# Altium schematic sheet 2_mb_conn.SchDoc: Motherboard connectors
size A3; SheetNumber: 2; SheetTotal: 8
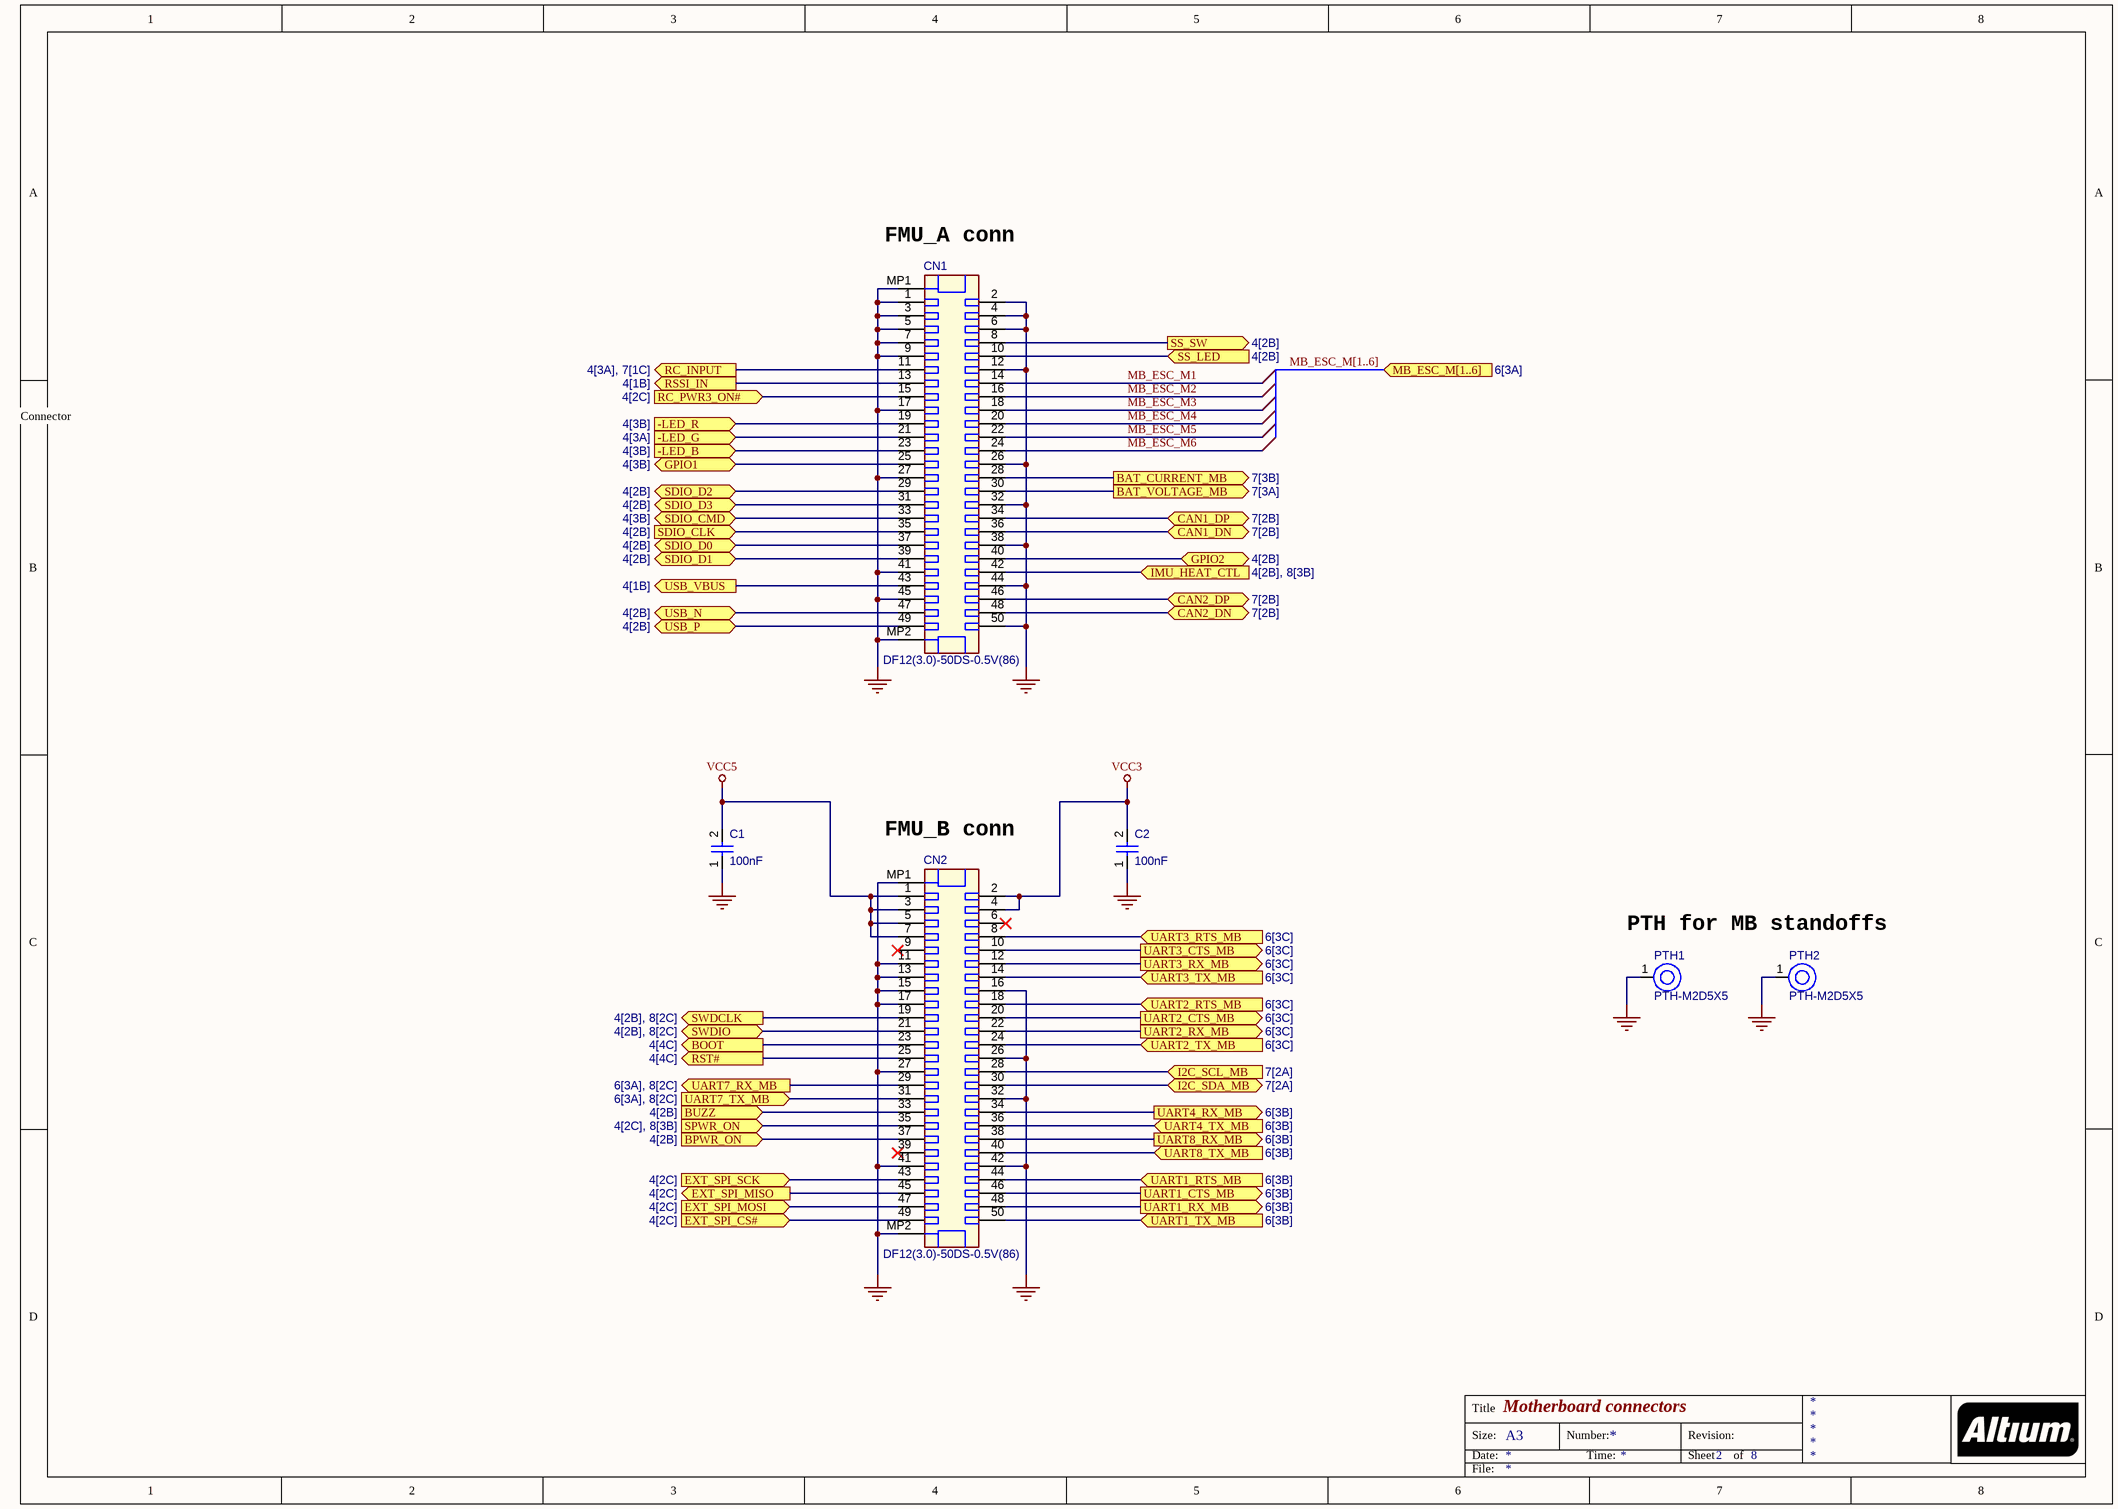
[diagram p0: 2_mb_conn.SchDoc]

## Parts
C1  value 100nF  [CAPC0402(1005)60_L]  (hidden comment: Capacitor 100nF +/-20% 10V 0402)
C2  value 100nF  [CAPC0402(1005)60_L]  (hidden comment: Capacitor 100nF +/-20% 10V 0402)
CN1  DF12(3.0)-50DS-0.5V(86)  [HIRO-DF12(3.0)-50DS-0.5V_V]
CN2  DF12(3.0)-50DS-0.5V(86)  [HIRO-DF12(3.0)-50DS-0.5V_V]
PTH1  PTH-M2D5X5  [PTH-M2D5X5]
PTH2  PTH-M2D5X5  [PTH-M2D5X5]

## Ports
-LED_B (in, see 4[3B]), -LED_G (in, see 4[3A]), -LED_R (in, see 4[3B]), BAT_CURRENT_MB (out, see 7[3B]), BAT_VOLTAGE_MB (out, see 7[3A]), BOOT (out, see 4[4C]), BPWR_ON (in, see 4[2B]), BUZZ (in, see 4[2B]), CAN1_DN (bidir, see 7[2B]), CAN1_DP (bidir, see 7[2B]), CAN2_DN (bidir, see 7[2B]), CAN2_DP (bidir, see 7[2B]), EXT_SPI_CS# (in, see 4[2C]), EXT_SPI_MISO (out, see 4[2C]), EXT_SPI_MOSI (in, see 4[2C]), EXT_SPI_SCK (in, see 4[2C]), GPIO1 (bidir, see 4[3B]), GPIO2 (bidir, see 4[2B]), I2C_SCL_MB (in, see 7[2A]), I2C_SDA_MB (bidir, see 7[2A]), IMU_HEAT_CTL (in, see 4[2B], 8[3B]), MB_ESC_M[1..6] (in, see 6[3A]), RC_INPUT (out, see 4[3A], 7[1C]), RC_PWR3_ON# (in, see 4[2C]), RSSI_IN (out, see 4[1B]), RST# (out, see 4[4C]), SDIO_CLK (in, see 4[2B]), SDIO_CMD (bidir, see 4[3B]), SDIO_D0 (bidir, see 4[2B]), SDIO_D1 (bidir, see 4[2B]), SDIO_D2 (bidir, see 4[2B]), SDIO_D3 (bidir, see 4[2B]), SPWR_ON (in, see 4[2C], 8[3B]), SS_LED (in, see 4[2B]), SS_SW (out, see 4[2B]), SWDCLK (out, see 4[2B], 8[2C]), SWDIO (bidir, see 4[2B], 8[2C]), UART1_CTS_MB (out, see 6[3B]), UART1_RTS_MB (in, see 6[3B]), UART1_RX_MB (out, see 6[3B]), UART1_TX_MB (in, see 6[3B]), UART2_CTS_MB (out, see 6[3C]), UART2_RTS_MB (in, see 6[3C]), UART2_RX_MB (out, see 6[3C]), UART2_TX_MB (in, see 6[3C]), UART3_CTS_MB (out, see 6[3C]), UART3_RTS_MB (in, see 6[3C]), UART3_RX_MB (out, see 6[3C]), UART3_TX_MB (in, see 6[3C]), UART4_RX_MB (out, see 6[3B]), UART4_TX_MB (in, see 6[3B]), UART7_RX_MB (out, see 6[3A], 8[2C]), UART7_TX_MB (in, see 6[3A], 8[2C]), UART8_RX_MB (out, see 6[3B]), UART8_TX_MB (in, see 6[3B]), USB_N (bidir, see 4[2B]), USB_P (bidir, see 4[2B]), USB_VBUS (out, see 4[1B])

## Nets
GND: C1.1 C2.1 CN1.1 CN1.2 CN1.3 CN1.4 CN1.5 CN1.6 CN1.7 CN1.9 CN1.12 CN1.17 CN1.26 CN1.27 CN1.32 CN1.38 CN1.41 CN1.44 CN1.45 CN1.50 CN1.MP1 CN1.MP2 CN2.11 CN2.13 CN2.15 CN2.16 CN2.17 CN2.26 CN2.27 CN2.32 CN2.41 CN2.42 CN2.MP1 CN2.MP2 PTH1.1(H1) PTH2.1(H1)
VCC3: C2.2 CN2.2 CN2.4
VCC5: C1.2 CN2.1 CN2.3 CN2.5 CN2.7
-LED_B: CN1.23 ; port -LED_B
-LED_G: CN1.21 ; port -LED_G
-LED_R: CN1.19 ; port -LED_R
BAT_CURRENT_MB: CN1.28 ; port BAT_CURRENT_MB
BAT_VOLTAGE_MB: CN1.30 ; port BAT_VOLTAGE_MB
BOOT: CN2.23 ; port BOOT
BPWR_ON: CN2.37 ; port BPWR_ON
BUZZ: CN2.33 ; port BUZZ
CAN1_DN: CN1.36 ; port CAN1_DN
CAN1_DP: CN1.34 ; port CAN1_DP
CAN2_DN: CN1.48 ; port CAN2_DN
CAN2_DP: CN1.46 ; port CAN2_DP
EXT_SPI_CS#: CN2.49 ; port EXT_SPI_CS#
EXT_SPI_MISO: CN2.45 ; port EXT_SPI_MISO
EXT_SPI_MOSI: CN2.47 ; port EXT_SPI_MOSI
EXT_SPI_SCK: CN2.43 ; port EXT_SPI_SCK
GPIO1: CN1.25 ; port GPIO1
GPIO2: CN1.40 ; port GPIO2
I2C_SCL_MB: CN2.28 ; port I2C_SCL_MB
I2C_SDA_MB: CN2.30 ; port I2C_SDA_MB
IMU_HEAT_CTL: CN1.42 ; port IMU_HEAT_CTL
MB_ESC_M1: CN1.14
MB_ESC_M2: CN1.16
MB_ESC_M3: CN1.18
MB_ESC_M4: CN1.20
MB_ESC_M5: CN1.22
MB_ESC_M6: CN1.24
RC_INPUT: CN1.11 ; port RC_INPUT
RC_PWR3_ON#: CN1.15 ; port RC_PWR3_ON#
RSSI_IN: CN1.13 ; port RSSI_IN
RST#: CN2.25 ; port RST#
SDIO_CLK: CN1.35 ; port SDIO_CLK
SDIO_CMD: CN1.33 ; port SDIO_CMD
SDIO_D0: CN1.37 ; port SDIO_D0
SDIO_D1: CN1.39 ; port SDIO_D1
SDIO_D2: CN1.29 ; port SDIO_D2
SDIO_D3: CN1.31 ; port SDIO_D3
SPWR_ON: CN2.35 ; port SPWR_ON
SS_LED: CN1.10 ; port SS_LED
SS_SW: CN1.8 ; port SS_SW
SWDCLK: CN2.19 ; port SWDCLK
SWDIO: CN2.21 ; port SWDIO
UART1_CTS_MB: CN2.46 ; port UART1_CTS_MB
UART1_RTS_MB: CN2.44 ; port UART1_RTS_MB
UART1_RX_MB: CN2.48 ; port UART1_RX_MB
UART1_TX_MB: CN2.50 ; port UART1_TX_MB
UART2_CTS_MB: CN2.20 ; port UART2_CTS_MB
UART2_RTS_MB: CN2.18 ; port UART2_RTS_MB
UART2_RX_MB: CN2.22 ; port UART2_RX_MB
UART2_TX_MB: CN2.24 ; port UART2_TX_MB
UART3_CTS_MB: CN2.10 ; port UART3_CTS_MB
UART3_RTS_MB: CN2.8 ; port UART3_RTS_MB
UART3_RX_MB: CN2.12 ; port UART3_RX_MB
UART3_TX_MB: CN2.14 ; port UART3_TX_MB
UART4_RX_MB: CN2.34 ; port UART4_RX_MB
UART4_TX_MB: CN2.36 ; port UART4_TX_MB
UART7_RX_MB: CN2.29 ; port UART7_RX_MB
UART7_TX_MB: CN2.31 ; port UART7_TX_MB
UART8_RX_MB: CN2.38 ; port UART8_RX_MB
UART8_TX_MB: CN2.40 ; port UART8_TX_MB
USB_N: CN1.47 ; port USB_N
USB_P: CN1.49 ; port USB_P
USB_VBUS: CN1.43 ; port USB_VBUS

Not connected (* = marked no-connect by the designer): CN2 6* 9* 39*

## Buses and harness runs
bus MB_ESC_M[1..6] = port MB_ESC_M[1..6]

## Notes on the sheet
- (near CN1) FMU_A conn
- Connector
- (near CN2) FMU_B conn
- PTH for MB standoffs
- Title
- Size:
- Date:
- A3
- Number:
- Time:
- Revision:
- Sheet
- of
- File:

## Library data of the parts
C1 C2 = CMP-001-00061-2: Chip Capacitor, 100nF +/-20%, 10V, 0402, Thickness 0.6 mm; Tolerance: 20%; Voltage Rating: 10V; Mounting Technology: SMT; Min Operating Temperature: -55°C; Pins: 2; Case/Package: 0402; Max Operating Temperature: 85°C
CN1 CN2 = CMP-002-00058-1: Receptacle Connector, 50 V, 0.3 A, -45 to 125 degC, RoHS, Tape and Reel; Pins: 52; System: Connector
PTH1 PTH2 = CMP-00028-00004-1: M2 PTH (2.5mm), 5mm pad; Pins: 1